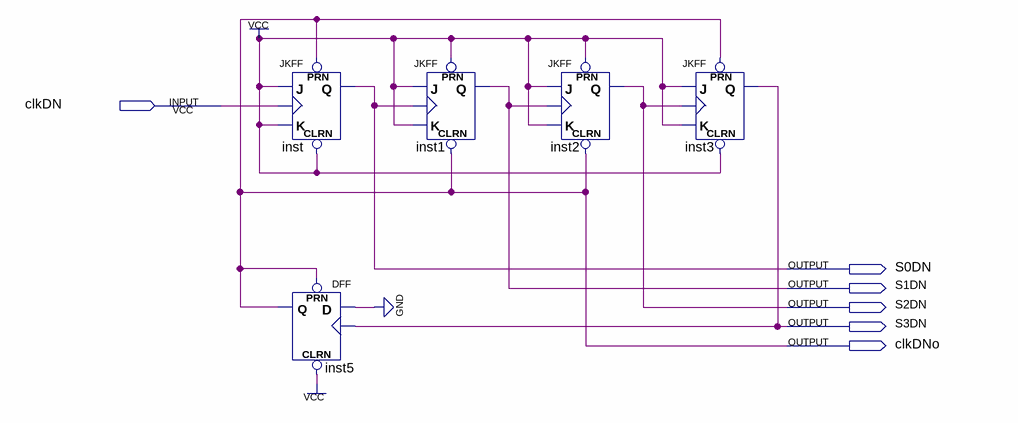
[diagram p0: schematic sheet]
// Quartus schematic contDN.bdf as structural Verilog: 5 symbols, 6 pins
module contDN (
  input  clkDN,
  output S0DN,
  output S1DN,
  output S2DN,
  output S3DN,
  output clkDNo
);

  JKFF inst (.PRN(clkDNo), .CLRN(1'b1), .K(1'b1), .J(1'b1), .CLK(clkDN), .Q(S0DN));
  DFF inst5 (.CLRN(1'b1), .CLK(S3DN), .D(1'b0), .PRN(clkDNo), .Q(clkDNo));
  JKFF inst1 (.PRN(1'b1), .CLRN(clkDNo), .K(1'b1), .J(1'b1), .CLK(S0DN), .Q(S1DN));
  JKFF inst2 (.PRN(1'b1), .CLRN(clkDNo), .K(1'b1), .J(1'b1), .CLK(S1DN), .Q(S2DN));
  JKFF inst3 (.PRN(clkDNo), .CLRN(1'b1), .K(1'b1), .J(1'b1), .CLK(S2DN), .Q(S3DN));
endmodule
